# EAGLE design schematic (EAGLE 6.6.0)
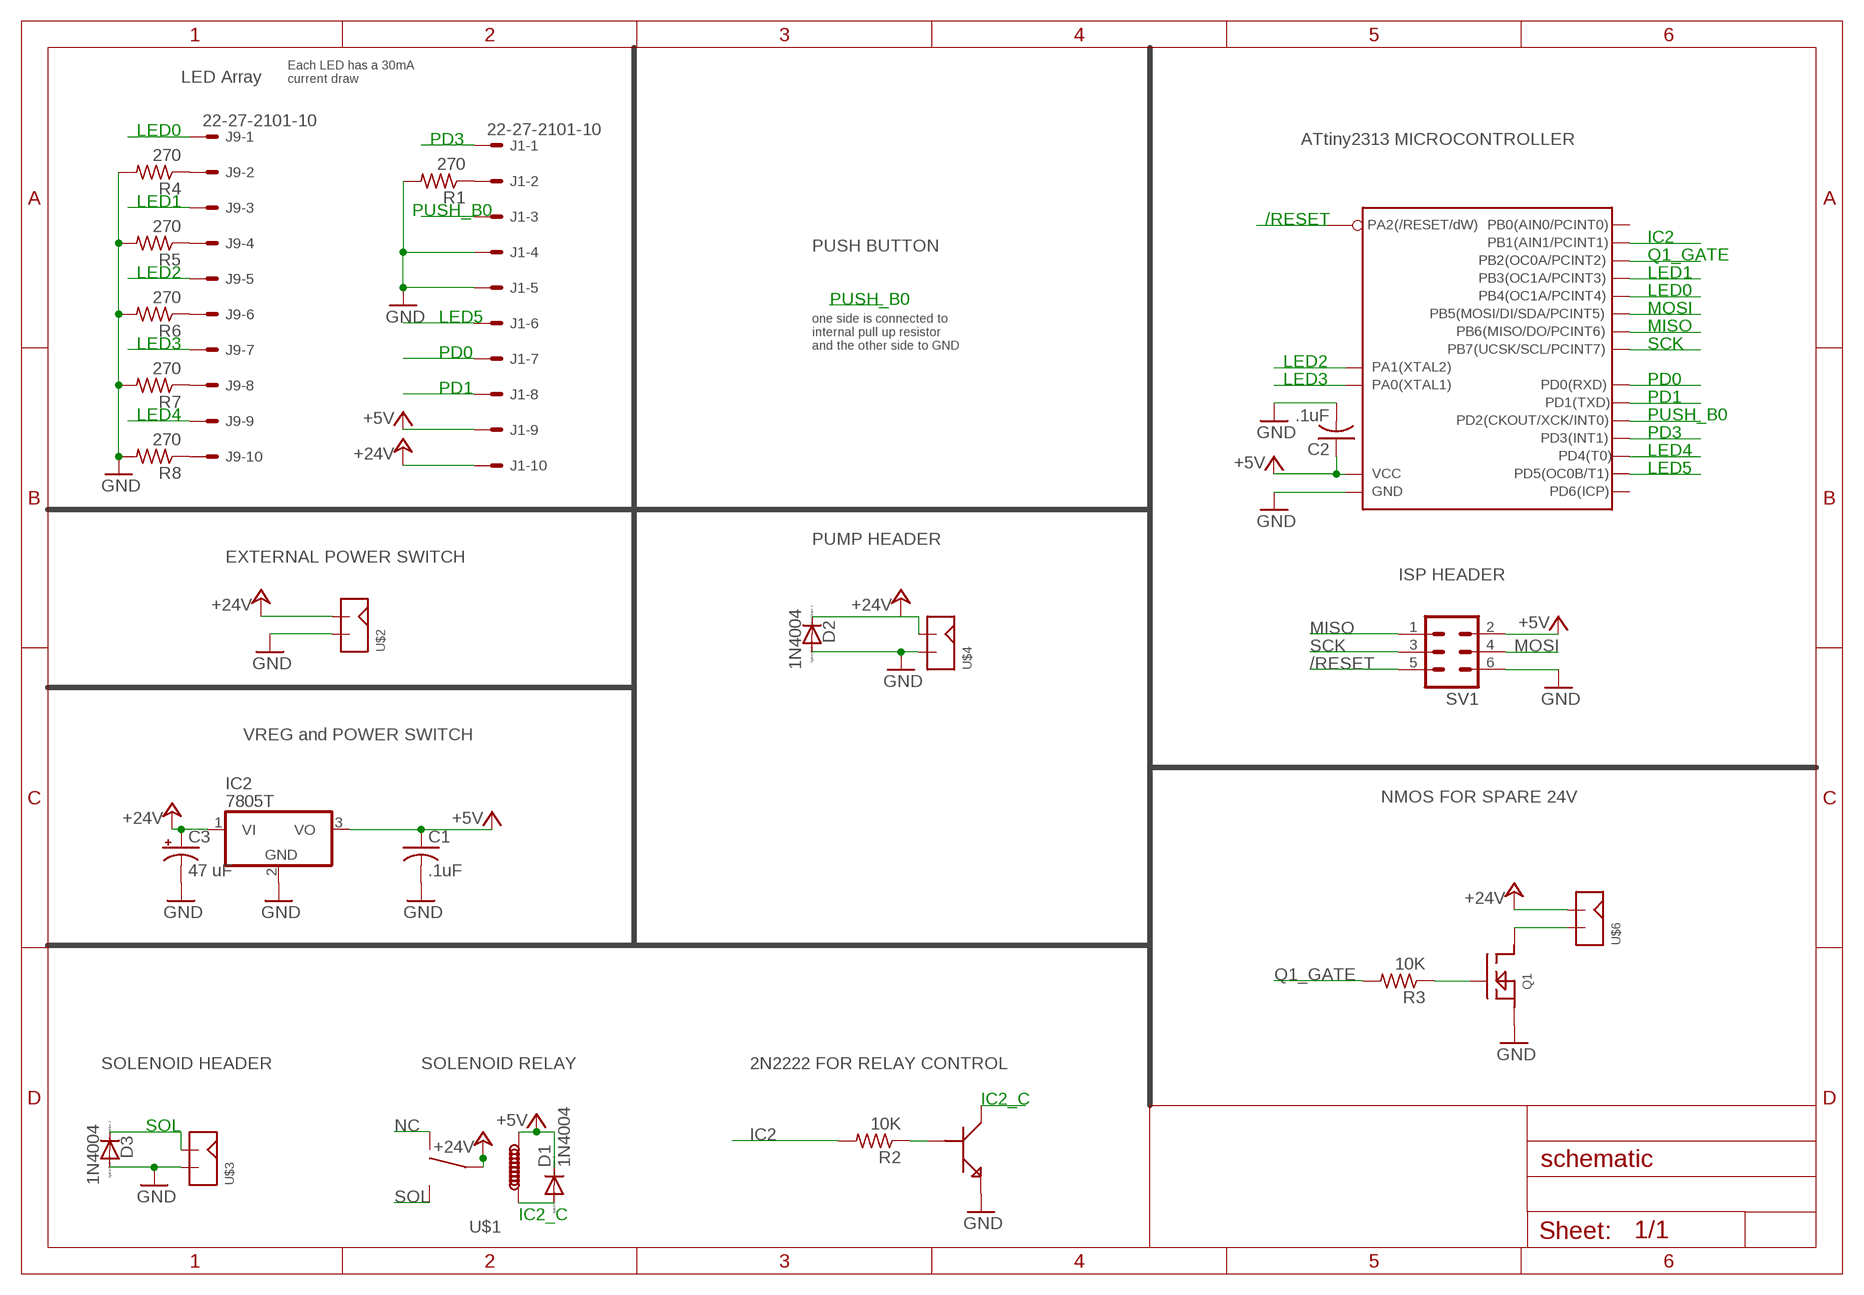
[diagram p0: schematic, sheet 1]

## Parts
C1  .1uF  C-US050-025X075  [C050-025X075]
C2  .1uF  C-US050-025X075  [C050-025X075]
C3  47 uF  CPOL-USB45181B  [B45181B]
D1  1N4004  [DO41-10]
D2  1N4004  [DO41-10]
D3  1N4004  [DO41-10]
IC2  7805T  [TO220H]
J1  22-27-2101-10  [6410-10]
J9  22-27-2101-10  [6410-10]
Q1  IRLD120  [HVMDIP]
R1  270  R-US_0204/7  [0204/7]
R2  10K  R-US_0204/7  [0204/7]
R3  10K  R-US_0204/7  [0204/7]
R4  270  R-US_0204/7  [0204/7]
R5  270  R-US_0204/7  [0204/7]
R6  270  R-US_0204/7  [0204/7]
R7  270  R-US_0204/7  [0204/7]
R8  270  R-US_0204/7  [0204/7]
SV1  MA03-2  [MA03-2]
U$1  JS1A-B-5V  [JS1A-B-5V]
U$2  644752_2  [644752-2]
U$3  644752_2  [644752-2]
U$4  644752_2  [644752-2]
U$5  P2N2222A  [P2N2222A]
U$6  644752_2  [644752-2]
U$7  ATTINY2313  [20_DIP_MICRO]

## Nets
+5V: C1.1 C2.1 D1.C IC2.3(VO) J1.9 SV1.2 U$1.VIN U$7.20
+24V: C3.+ D2.C IC2.1(VI) J1.10 U$1.COM U$2.PIN1 U$4.PIN1 U$6.PIN1
/RESET: SV1.5 U$7.1
GND: C1.2 C2.2 C3.- D2.A D3.A IC2.2(GND) J1.4 J1.5 Q1.S R1.2 R4.2 R5.2 R6.2 R7.2 R8.2 SV1.6 U$2.PIN2 U$3.PIN2 U$4.PIN2 U$5.EMITTER U$7.10
IC2: R2.2 U$7.13
IC2_C: D1.A U$1.GND U$5.COLLECTOR
LED0: J9.1 U$7.16
LED1: J9.3 U$7.15
LED2: J9.5 U$7.4
LED3: J9.7 U$7.5
LED4: J9.9 U$7.8
LED5: J1.6 U$7.9
MISO: SV1.1 U$7.18
MOSI: SV1.4 U$7.17
N$1: R2.1 U$5.BASE
N$2: Q1.G R3.1
N$3: J9.2 R4.1
N$4: Q1.D Q1.D2(D) U$6.PIN2
N$5: J1.2 R1.1
N$6: J9.4 R5.1
N$8: J9.6 R6.1
N$10: J9.8 R7.1
N$11: J9.10 R8.1
NC: U$1.N.C.(NC)
PD0: J1.7 U$7.2
PD1: J1.8 U$7.3
PD3: J1.1 U$7.7
PUSH_B0: J1.3 U$7.6
Q1_GATE: R3.2 U$7.14
SCK: SV1.3 U$7.19
SOL: D3.C U$1.N.O.(NO) U$3.PIN1
Unconnected: U$7.11 U$7.12

## Notes on the sheet
- LED Array
- Each LED has a 30mA 
  current draw
- ATtiny2313 MICROCONTROLLER
- PUSH BUTTON
- one side is connected to
  internal pull up resistor
  and the other side to GND
- PUMP HEADER
- EXTERNAL POWER SWITCH
- ISP HEADER
- VREG and POWER SWITCH
- NMOS FOR SPARE 24V
- SOLENOID HEADER | SOLENOID RELAY | 2N2222 FOR RELAY CONTROL

## Library data of the parts
C1 C2 = resistor:C-US: CAPACITOR, American symbol
C3 = resistor:CPOL-US: POLARIZED CAPACITOR, American symbol
D1-D3 = diode:1N4004: DIODE general purpose rectifier, 1 A
IC2 = linear:78*: Positive VOLTAGE REGULATOR Source: http://cache.national.com/ds/LM/LM78L05.pdf http://www.fairchildsemi.com/ds/LM/LM7805.pdf
J1 J9 = con-molex:22-?-10: CONNECTOR wire to board 2.54 mm (.1 inch) pitch header; OC_FARNELL: unknown; OC_NEWARK: unknown
Q1 = custom:IRLD120
R1-R8 = resistor:R-US_: RESISTOR, American symbol
SV1 = con-lstb:MA03-2: PIN HEADER; OC_FARNELL: unknown; OC_NEWARK: unknown
U$1 = JS1A:JS1A-B-5V
U$2-U$4 U$6 = 644752_2:644752_2
U$5 = P2N2222A:P2N2222A
U$7 = custom:ATTINY2313

## Board
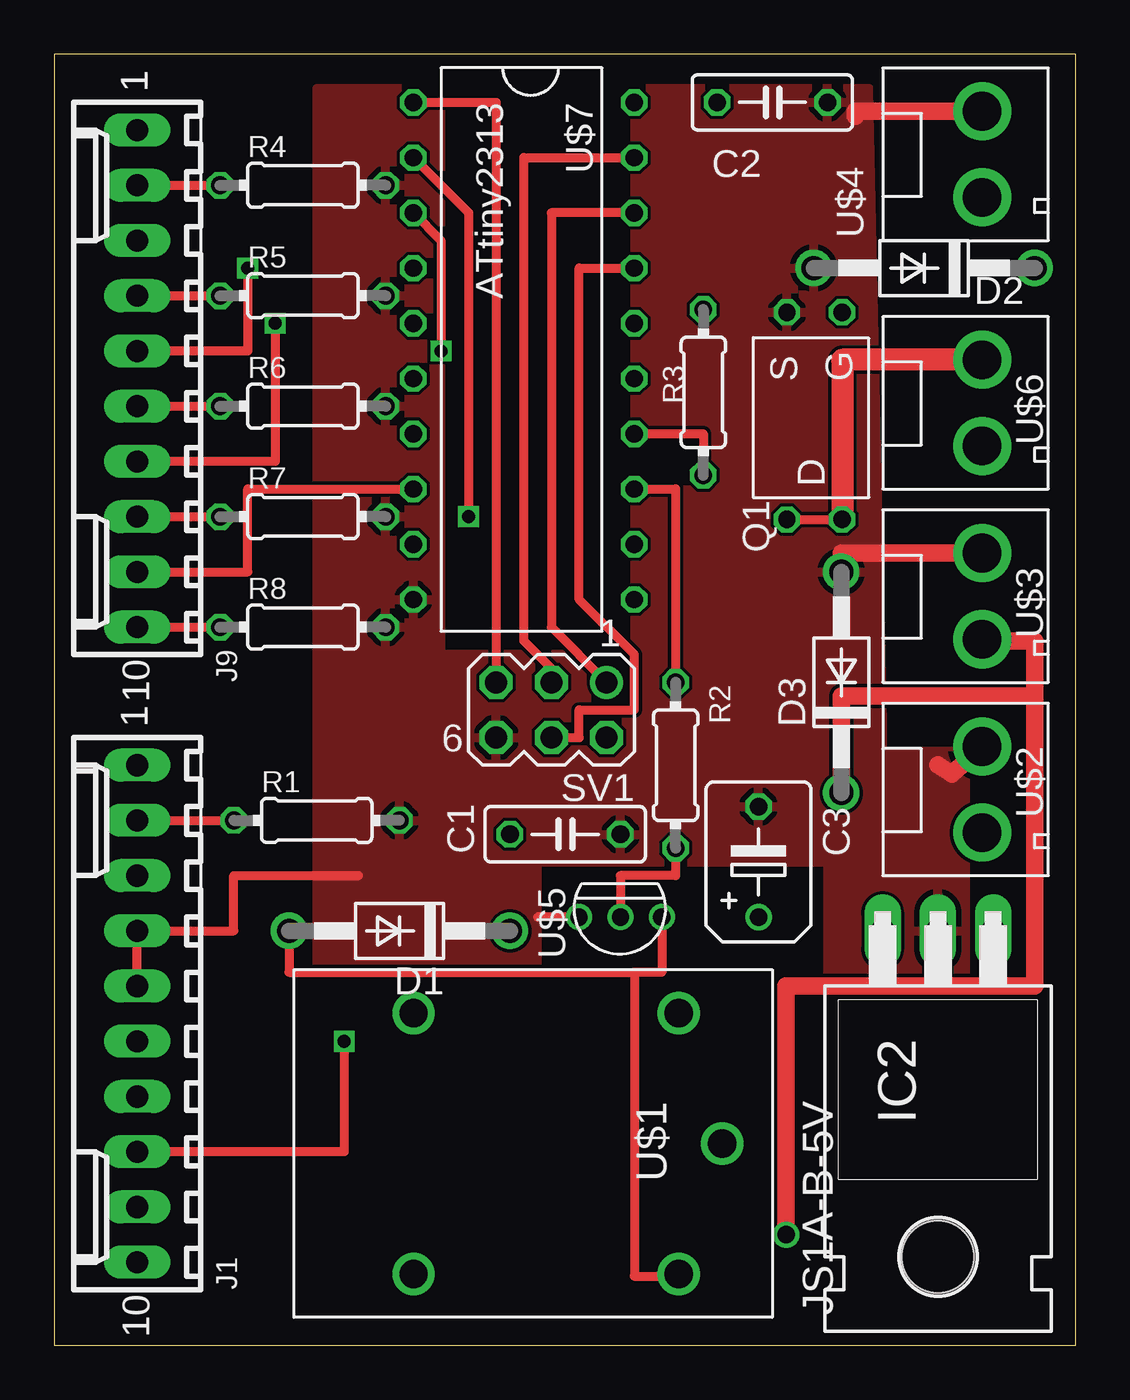
[diagram p1: board, top side]
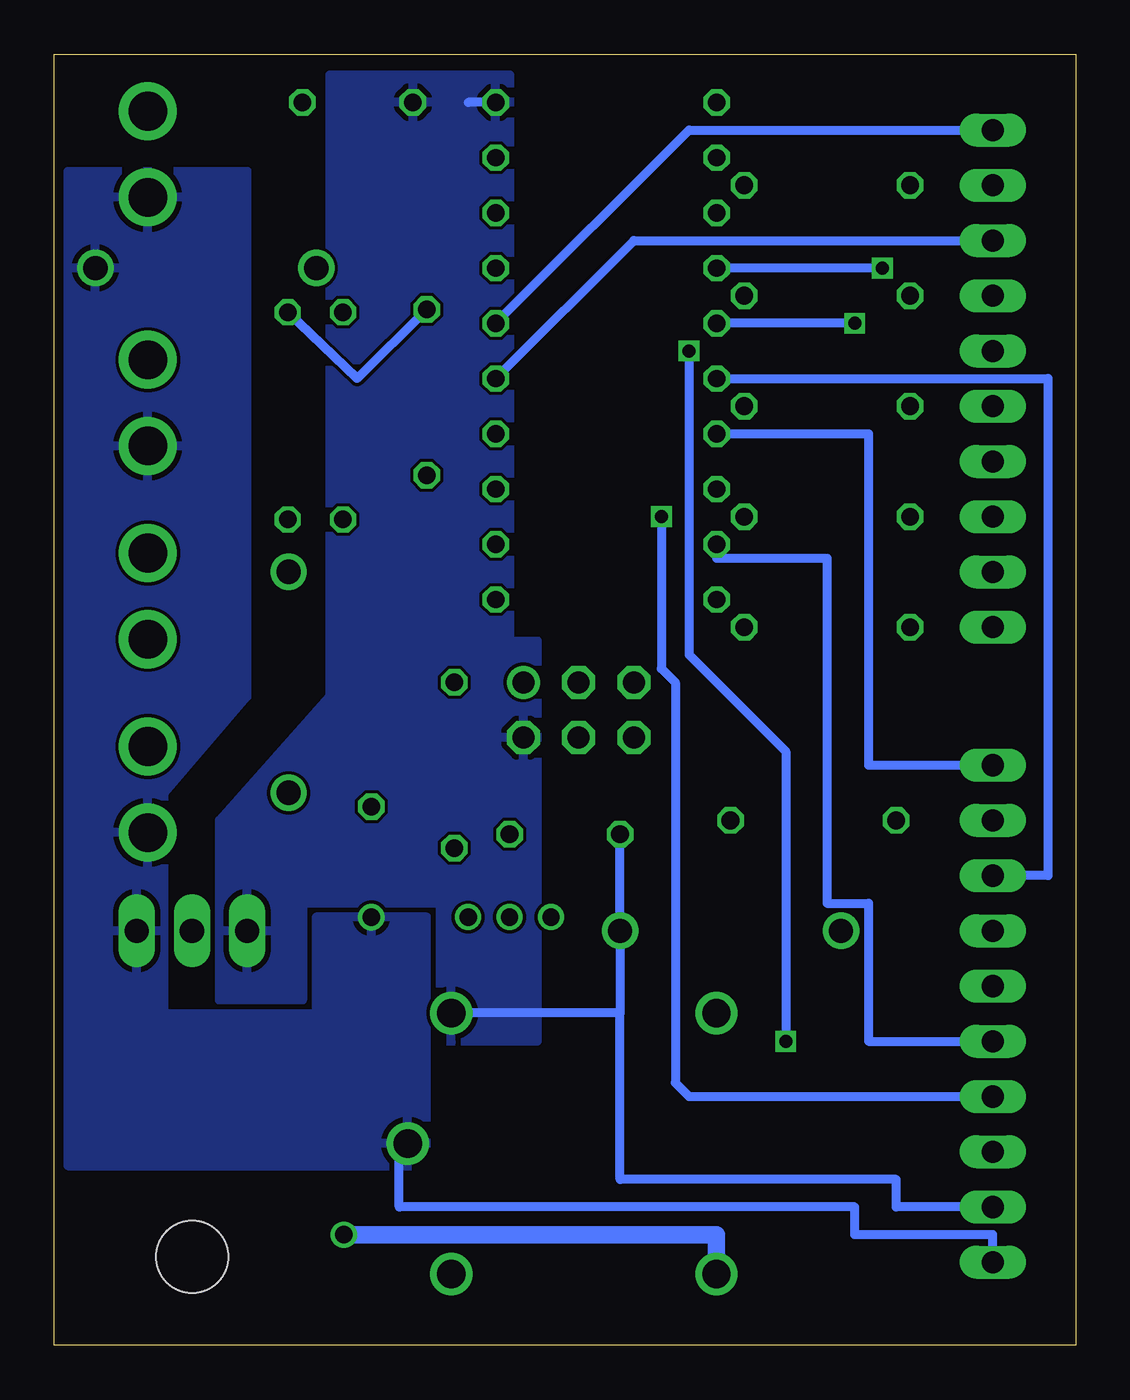
[diagram p2: board, bottom side, seen from below]

Size 46.97 x 59.36 mm. Coordinates in mm from the lower left corner, seen from the top.
Outline: 0,0 46.97,0 46.97,59.36 0,59.36 0,0
Copper layers (1*16): Top 0.0356mm / dielectric 1.5011mm / Bottom 0.0356mm
Design rules "LaenPCBOrder": minimum track width 6mil, minimum drill 13mil, track to track 6mil, track to pad 6mil, pad to pad 6mil, via to via 6mil, smd to smd 6mil, copper to edge 15mil, drill to drill 6mil, minimum pad ring 7mil, minimum via ring 7mil, stop-mask expansion 3mil, vias tented up to drill 0mil, thermal gap 10mil

### Footprints (pad centres in the part's own frame; a part is rotated, then mirrored left to right if it is on the bottom)
C050-025X075 = drill 0.813 octagon: 1 -2.54,0; 2 2.54,0
B45181B = drill 0.813: + -2.54,0 | drill 0.813 octagon: - 2.54,0
DO41-10 = drill 1.118: A 5.08,0; C -5.08,0
TO220H = drill 1.118 long: 1 -2.54,-10.16; 2 0,-10.16; 3 2.54,-10.16 | hole 3.302: 0,4.826
6410-10 = drill 1.016 long: 1 11.43,0; 2 8.89,0; 3 6.35,0; 4 3.81,0; 5 1.27,0; 6 -1.27,0; 7 -3.81,0; 8 -6.35,0; 9 -8.89,0; 10 -11.43,0
HVMDIP = drill 0.8 octagon: D -4.572,1.232; D2 -4.572,-1.308; G 4.953,-1.308; S 4.953,1.232
0204/7 = drill 0.813 octagon: 1 -3.81,0; 2 3.81,0
MA03-2 = drill 1.016: 1 -2.54,-1.27 | drill 1.016 octagon: 2 -2.54,1.27; 3 0,-1.27; 4 0,1.27; 5 2.54,-1.27; 6 2.54,1.27
JS1A-B-5V = drill 1.3: COM 8,2.3; GND 2,4.3; N.C. 14,16.5; N.O. 2,16.5; VIN 14,4.3
644752-2 = drill 1.778: PIN1 -1.829,-0.762; PIN2 2.134,-0.762
P2N2222A = drill 0.8: BASE 0,0; COLLECTOR 1.905,0; EMITTER -1.905,0
20_DIP_MICRO = drill 0.8 octagon: 1 -10.795,-5.08; 2 -8.255,-5.08; 3 -5.715,-5.08; 4 -3.175,-5.08; 5 -0.635,-5.08; 6 1.905,-5.08; 7 4.445,-5.08; 8 6.985,-5.08; 9 9.525,-5.08; 10 12.065,-5.08; 11 12.065,5.08; 12 9.525,5.08; 13 6.985,5.08; 14 4.445,5.08; 15 1.905,5.08; 16 -0.635,5.08; 17 -3.175,5.08; 18 -5.715,5.08; 19 -8.255,5.08; 20 -10.795,5.08

### Placement (x,y rotation side)
C1  23.5,23.5 0 top
C2  33.02,57.15 0 top
C3  32.38,22.23 90 top
D1  15.88,19.05 180 top
D2  40.01,49.53 180 top
D3  36.2,30.48 90 top
IC2  40.64,8.89 180 top
J1  3.81,15.24 90 top
J9  3.81,44.45 90 top
Q1  34.92,42.55 90 top
R1  12.06,24.13 0 top
R2  28.57,26.67 90 top
R3  29.84,43.81 270 top
R4  11.43,53.34 0 top
R5  11.43,48.26 0 top
R6  11.43,43.18 0 top
R7  11.43,38.1 0 top
R8  11.43,33.02 0 top
SV1  22.86,29.21 180 top
U$1  33.02,1.27 90 top
U$2  41.91,25.4 90 top
U$3  41.91,34.29 90 top
U$4  41.91,54.61 90 top
U$5  26.04,19.68 0 top
U$6  41.91,43.18 90 top
U$7  21.59,46.35 270 top

### Tracks (layer width: path | path; a pad name or v marks a point on that pad's centre or on a via)
+5V
  Bottom 0.406: 20.95,15.27 D1.C C1.1 | 20.95,15.27 U$1.VIN | J1.9 8.26,6.35 8.26,7.62 20.95,7.62 20.95,15.27 | U$7.20 27.94,57.15
  pour Bottom: 39.37,15.88 39.37,24.13 34.29,29.84 34.29,58.42 26.04,58.42 26.04,32.38 24.77,32.38 24.77,13.97 29.21,13.97 29.21,20.32 35.56,20.32 35.56,15.88
+24V
  Bottom 0.406: J1.10 3.81,5.08 10.16,5.08 10.16,6.35 31.11,6.35 31.11,9.27 U$1.COM
  pour Bottom: 29.84,8.26 29.84,19.68 34.92,19.68 34.92,15.24 41.91,15.24 41.91,25.4 38.1,29.84 38.1,53.98 46.35,53.98 46.35,8.26
/RESET
  Top 0.406: U$7.1 20.32,57.15 SV1.5
GND
  Top 0.406: U$5.EMITTER 22.23,19.68 | J1.5 J1.4 8.26,19.05 8.26,21.59 13.97,21.59
  Top 0.813: U$4.PIN2 36.83,56.74 36.83,56.52 | U$3.PIN2 36.2,36.42 D3.A | U$2.PIN2 41.27,26.26 40.64,26.67
  pour Top: 12.06,57.78 12.06,14.61 22.23,14.61 22.23,22.23 35.56,22.23 35.56,15.24 41.91,15.24 41.91,27.3 38.1,27.3 38.1,28.57 37.47,57.78 26.67,57.78 26.67,32.38 26.04,32.38 26.04,31.75 17.78,31.75 17.78,57.78
IC2
  Top 0.406: U$7.13 28.57,39.37 R2.2
IC2_C
  Top 0.406: U$5.COLLECTOR 27.94,17.14 26.67,17.14 | 26.67,17.14 26.67,3.17 28.72,3.17 U$1.GND | D1.A 10.79,17.14 26.67,17.14
LED0
  Bottom 0.406: U$7.16 17.78,55.88 J9.1
LED1
  Bottom 0.406: U$7.15 20.32,50.8 J9.3
LED2  (via drill 0.6)
  Top 0.406: v8.89,49.53 8.89,45.72 J9.5
  Bottom 0.406: v8.89,49.53 U$7.4
LED3  (via drill 0.6)
  Top 0.406: v10.16,46.99 10.16,40.64 J9.7
  Bottom 0.406: v10.16,46.99 U$7.5
LED4
  Top 0.406: J9.9 8.89,35.56 8.89,39.37 U$7.8
LED5
  Bottom 0.406: U$7.9 16.51,36.2 11.43,36.2 11.43,20.32 9.53,20.32 9.53,13.97 J1.6
MISO
  Top 0.406: U$7.18 22.86,52.07 22.86,33.02 SV1.1
MOSI
  Top 0.406: SV1.4 24.13,27.94 24.13,29.21 26.67,29.21 26.67,31.75 24.13,34.29 24.13,49.53 U$7.17
N$1
  Top 0.406: R2.1 28.57,21.59 26.04,21.59 U$5.BASE
N$2
  Bottom 0.406: R3.1 33.06,44.45 Q1.G
N$3
  Top 0.406: J9.2 R4.1
N$4
  Top 0.406: Q1.D Q1.D2
  Top 1.016: U$6.PIN2 36.23,45.31 Q1.D2
N$5
  Top 0.406: J1.2 R1.1
N$6
  Top 0.406: J9.4 R5.1
N$8
  Top 0.406: J9.6 R6.1
N$10
  Top 0.406: J9.8 R7.1
N$11
  Top 0.406: J9.10 R8.1
PD0  (via drill 0.6)
  Top 0.406: U$7.2 19.05,52.07 v19.05,38.1
  Bottom 0.406: v19.05,38.1 19.05,31.11 18.41,30.48 18.41,12.06 17.78,11.43 J1.7
PD1  (via drill 0.6)
  Top 0.406: U$7.3 17.78,50.8 v17.78,45.72 | v13.34,13.97 13.34,8.89 J1.8
  Bottom 0.406: v17.78,45.72 17.78,31.75 13.34,27.3 v13.34,13.97
PD3
  Bottom 0.406: U$7.7 9.53,41.91 9.53,26.67 J1.1
PUSH_B0
  Bottom 0.406: U$7.6 1.27,44.45 1.27,21.59 J1.3
Q1_GATE
  Top 0.406: U$7.14 29.84,41.91 R3.2
SCK
  Top 0.406: SV1.3 22.86,31.11 21.59,32.38 21.59,54.61 U$7.19
SOL  (via drill 0.8)
  Top 0.813: U$3.PIN1 42.67,32.38 45.09,32.38 45.09,29.84 | 45.09,29.84 45.09,16.51 33.66,16.51 v33.66,5.08 | D3.C 36.2,29.84 45.09,29.84
  Bottom 0.813: U$1.N.O. 16.51,5.08 v33.66,5.08